# EAGLE design tiny-uC-13 (EAGLE 5.07)
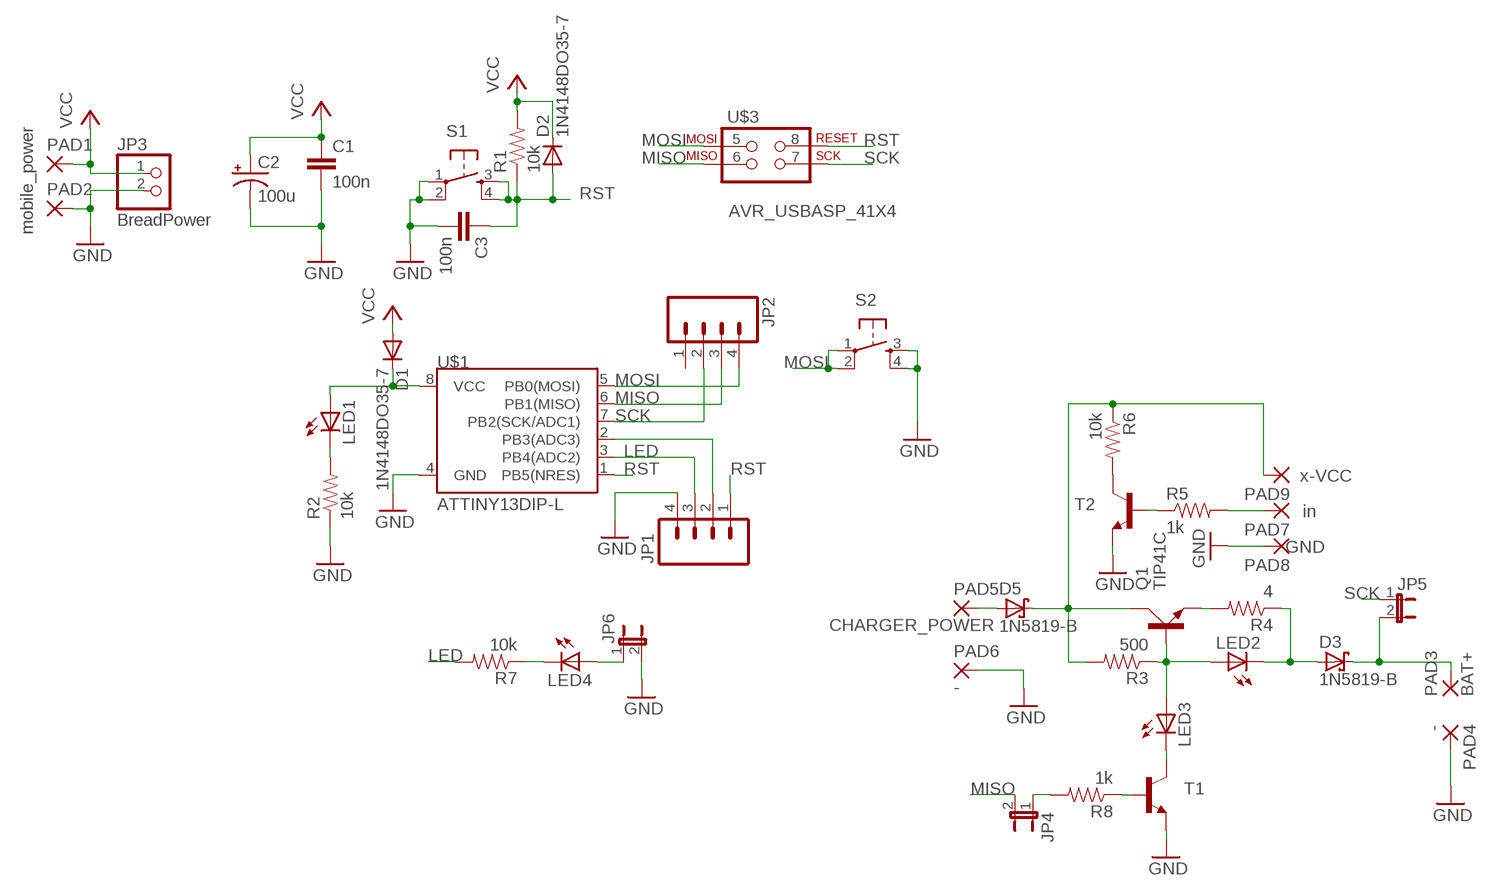
[diagram p0: schematic, sheet 1]

## Parts
C1  100n  CAP0805  [0805]
C2  100u  CAP_POLD  [PANASONIC_D]
C3  100n  CAP0805  [0805]
D1  1N4148DO35-7  [DO35-7]
D2  1N4148DO35-7  [DO35-7]
D3  1N5819-B  [DO41-7.6]
D5  1N5819-B  [DO41-7.6]
JP1  M04LOCK_LONGPADS  [1X04_LOCK_LONGPADS]
JP2  M04LOCK_LONGPADS  [1X04_LOCK_LONGPADS]
JP3  BreadPower  PINHD-1X2  [1X02]
JP4  JUMPER-2PTH  [1X02]
JP5  JUMPER-2PTH  [1X02]
JP6  JUMPER-2PTH  [1X02]
LED1  LEDCHIP-LED0805  [CHIP-LED0805]
LED2  LEDCHIP-LED0805  [CHIP-LED0805]
LED3  LEDCHIP-LED0805  [CHIP-LED0805]
LED4  LEDCHIP-LED0805  [CHIP-LED0805]
PAD1  mobile_power  2,54/0,8  [2,54/0,8]
PAD2  2,54/0,8  [2,54/0,8]
PAD3  BAT+  2,54/1,0  [2,54/1,0]
PAD4  -  2,54/1,0  [2,54/1,0]
PAD5  CHARGER_POWER  2,54/1,0  [2,54/1,0]
PAD6  -  2,54/1,0  [2,54/1,0]
PAD7  in  1,6/0,8  [1,6/0,8]
PAD8  GND  1,6/0,8  [1,6/0,8]
PAD9  x-VCC  1,6/0,8  [1,6/0,8]
Q1  TIP41C  [TO220AV]
R1  10k  RESISTOR1/4W  [AXIAL-0.3]
R2  10k  RESISTOR  [0805]
R3  500  RESISTOR  [0805]
R4  4  RESISTOR1/4W  [AXIAL-0.3]
R5  1k  RESISTOR  [0805]
R6  10k  RESISTOR  [0805]
R7  10k  RESISTOR  [0805]
R8  1k  RESISTOR  [0805]
S1  TAC_SWITCHPTH  [TACTILE-PTH]
S2  TAC_SWITCHPTH  [TACTILE-PTH]
T1  TRANSISTOR_NPNSOT23  [SOT23]
T2  TRANSISTOR_NPNSOT23  [SOT23]
U$1  ATTINY13DIP-L  [DIP08-L]
U$3  AVR_USBASP_41X4  [1X4]

## Nets
ADC: JP1.2 U$1.2(PB3(ADC3))
GND: C1.2 C2.- C3.2 JP1.4 JP3.2 JP6.2 PAD2.1(P) PAD4.1(P) PAD6.1(P) PAD8.1(P) R2.1 S1.1 S1.2 S2.3 S2.4 T1.2(E) T2.2(E) U$1.4(GND)
LED: JP1.3 R7.2 U$1.3(PB4(ADC2))
LI-CHARGE: D3.C JP5.2 PAD3.1(P)
MISO: JP2.3 JP4.2 U$1.6(PB1(MISO)) U$3.6
MOSI: JP2.4 S2.1 S2.2 U$1.5(PB0(MOSI)) U$3.5
N$2: R8.1 T1.1(B)
N$3: LED2.A LED3.A Q1.B R3.1
N$4: LED1.C R2.2
N$5: D1.C LED1.A U$1.8(VCC)
N$6: D3.A LED2.C R4.P$1
N$7: R6.2 T2.3(C)
N$8: Q1.E R4.P$2
N$9: JP4.1 R8.2
N$10: D5.C PAD9.1(P) Q1.C R3.2 R6.1
N$11: LED3.C T1.3(C)
N$12: R5.1 T2.1(B)
N$13: D5.A PAD5.1(P)
N$14: PAD7.1(P) R5.2
N$15: JP6.1 LED4.A
N$16: LED4.C R7.1
RST: C3.1 D2.A JP1.1 R1.P$1 S1.3 S1.4 U$1.1(PB5(NRES)) U$3.8
SCK: JP2.2 JP5.1 U$1.7(PB2(SCK/ADC1)) U$3.7
VCC: C1.1 C2.+ D1.A D2.C JP3.1 PAD1.1(P) R1.P$2
Unconnected: JP2.1

## Library data of the parts
C1 C3 = SparkFun:CAP: Capacitor Standard 0603 ceramic capacitor, and 0.1" leaded capacitor.
C2 = SparkFun:CAP_POL: Capacitor Polarized These are standard SMD and PTH capacitors. Normally 10uF, 47uF, and 100uF in electrolytic and tantalum varieties. Always verify the external diameter of the through hole cap, it varies with capacity, voltage, and manufacturer. The EIA devices should be standard.
D1 D2 = diode:1N4148: DIODE high speed (Philips)
D3 D5 = diode:1N581*: 1.0A SCHOTTKY BARRIER RECTIFIER Source: http://www.diodes.com/datasheets/ds23001.pdf
JP1 JP2 = SparkFun:M04: Header 4 Standard 4-pin 0.1" header. Use with straight break away headers (SKU : PRT-00116), right angle break away headers (PRT-00553), swiss pins (PRT-00743), machine pins (PRT-00117), and female headers (PRT-00115). Molex polarized connector foot print use with SKU : PRT-08231 with associated crimp pins and housings.
JP3 = pinhead:PINHD-1X2: PIN HEADER
JP4-JP6 = SparkFun:JUMPER-2: Jumper Basic 0.1" spaced jumper. Use with breakaway headers.
LED1-LED4 = led:LED: LED OSRAM: - CHIPLED LG R971, LG N971, LY N971, LG Q971, LY Q971, LO R971, LY R971 LH N974, LH R974 LS Q976, LO Q976, LY Q976 LO Q996 - Hyper CHIPLED LW Q18S LB Q993, LB Q99A, LB R99A - SideLED LS A670, LO A670, LY A670, LG A670, LP A670 LB A673, LV A673, LT A673, LW A673 LH A674 LY A675 LS A676, LA A676, LO A676, LY A676, LW A676 LS A679, LY A679, LG A679 - Hyper Micro SIDELED® LS Y876, LA Y876, LO Y876, LY Y876 LT Y87S - SmartLED LW L88C, LW L88S LB L89C, LB L89S, LG L890 LS L89K, LO L89K, LY L89K LS L896, LA L896, LO L896, LY L896 - TOPLED LS T670, LO T670, LY T670, LG T670, LP T670 LSG T670, LSP T670, LSY T670, LOP T670, LYG T670 LG T671, LOG T671, LSG T671 LB T673, LV T673, LT T673, LW T673 LH T674 LS T676, LA T676, LO T676, LY T676, LB T676, LH T676, LSB T676, LW T676 LB T67C, LV T67C, LT T67C, LS T67K, LO T67K, LY T67K, LW E67C LS E67B, LA E67B, LO E67B, LY E67B, LB E67C, LV E67C, LT E67C LW T67C LS T679, LY T679, LG T679 LS T770, LO T770, LY T770, LG T770, LP T770 LB T773, LV T773, LT T773, LW T773 LH T774 LS E675, LA E675, LY E675, LS T675 LS T776, LA T776, LO T776, LY T776, LB T776 LHGB T686 LT T68C, LB T68C - Hyper Mini TOPLED® LB M676 - Mini TOPLED Santana® LG M470 LS M47K, LO M47K, LY M47K Source: http://www.osram.convergy.de LUXEON: - LUMILED® LXK2-PW12-R00, LXK2-PW12-S00, LXK2-PW14-U00, LXK2-PW14-V00 LXK2-PM12-R00, LXK2-PM12-S00, LXK2-PM14-U00 LXK2-PE12-Q00, LXK2-PE12-R00, LXK2-PE12-S00, LXK2-PE14-T00, LXK2-PE14-U00 LXK2-PB12-K00, LXK2-PB12-L00, LXK2-PB12-M00, LXK2-PB14-N00, LXK2-PB14-P00, LXK2-PB14-Q00 LXK2-PR12-L00, LXK2-PR12-M00, LXK2-PR14-Q00, LXK2-PR14-R00 LXK2-PD12-Q00, LXK2-PD12-R00, LXK2-PD12-S00 LXK2-PH12-R00, LXK2-PH12-S00 LXK2-PL12-P00, LXK2-PL12-Q00, LXK2-PL12-R00 Source: www.luxeon.com KINGBRIGHT: KA-3528ASYC Source: www.kingbright.com
PAD1 PAD2 = wirepad:2,54/0,8: THROUGH-HOLE PAD
PAD3-PAD6 = wirepad:2,54/1,0: THROUGH-HOLE PAD
PAD7-PAD9 = wirepad:1,6/0,8: THROUGH-HOLE PAD
Q1 = transistor-power:TIP41C: NPN TRANSISTOR
R1-R8 = digital-toy:RESISTOR: Resistor Basic schematic elements and footprints for 0603, 1206, and PTH 1/10th watt (small) resistors.
S1 S2 = SparkFun:TAC_SWITCH: Momentary Switch Button commonly used for reset or general input. Spark Fun Electronics SKU : COM-00097
T1 T2 = SparkFun:TRANSISTOR_NPN: Transistor NPN BJT configuration in SOT23 package. MMBT2222 is the common NPN we use. Double check BCE configuration again layout.
U$1 = digital-toy:ATTINY13
U$3 = digital-toy:AVR_USBASP_4: AVR ISP 6 Pin This is the reduced ISP connector for AVR programming. Common on Arduino. This footprint will take up less PCB space and can be used with a 10-pin to 6-pin adapter such as SKU: BOB-08508

## Board
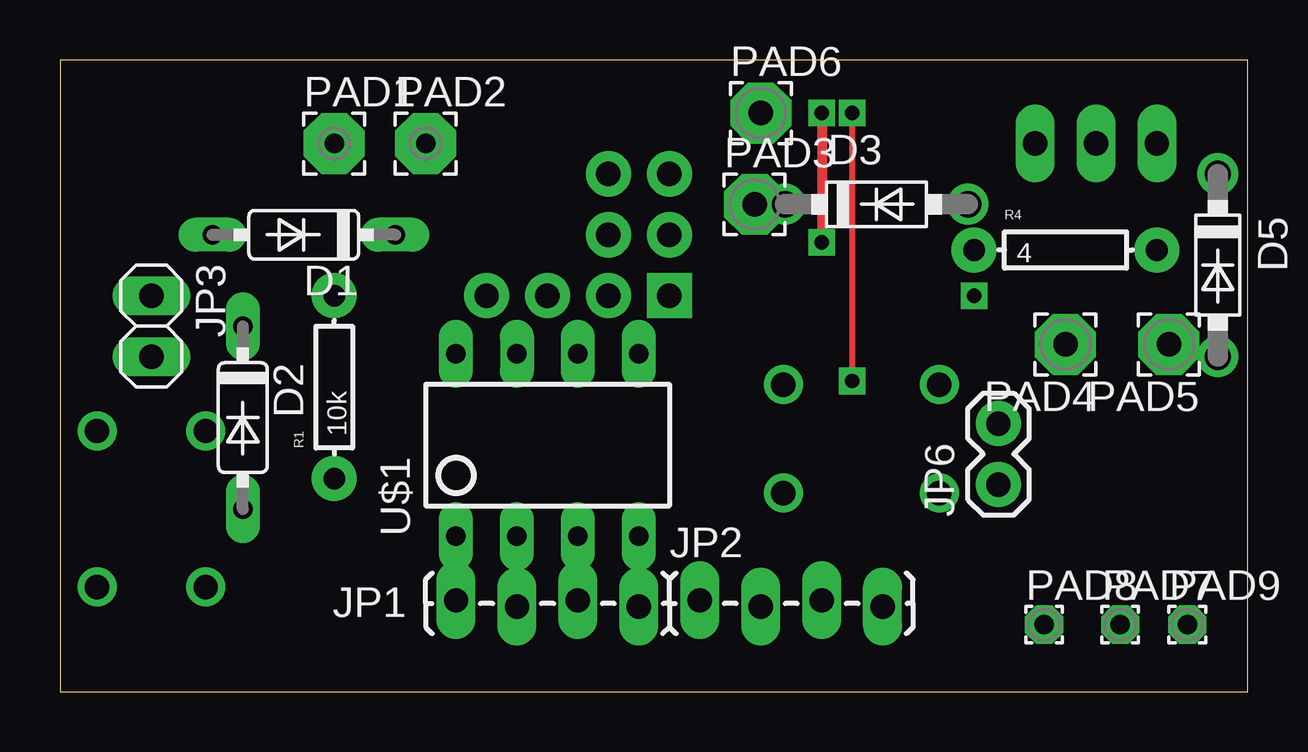
[diagram p1: board, top side]
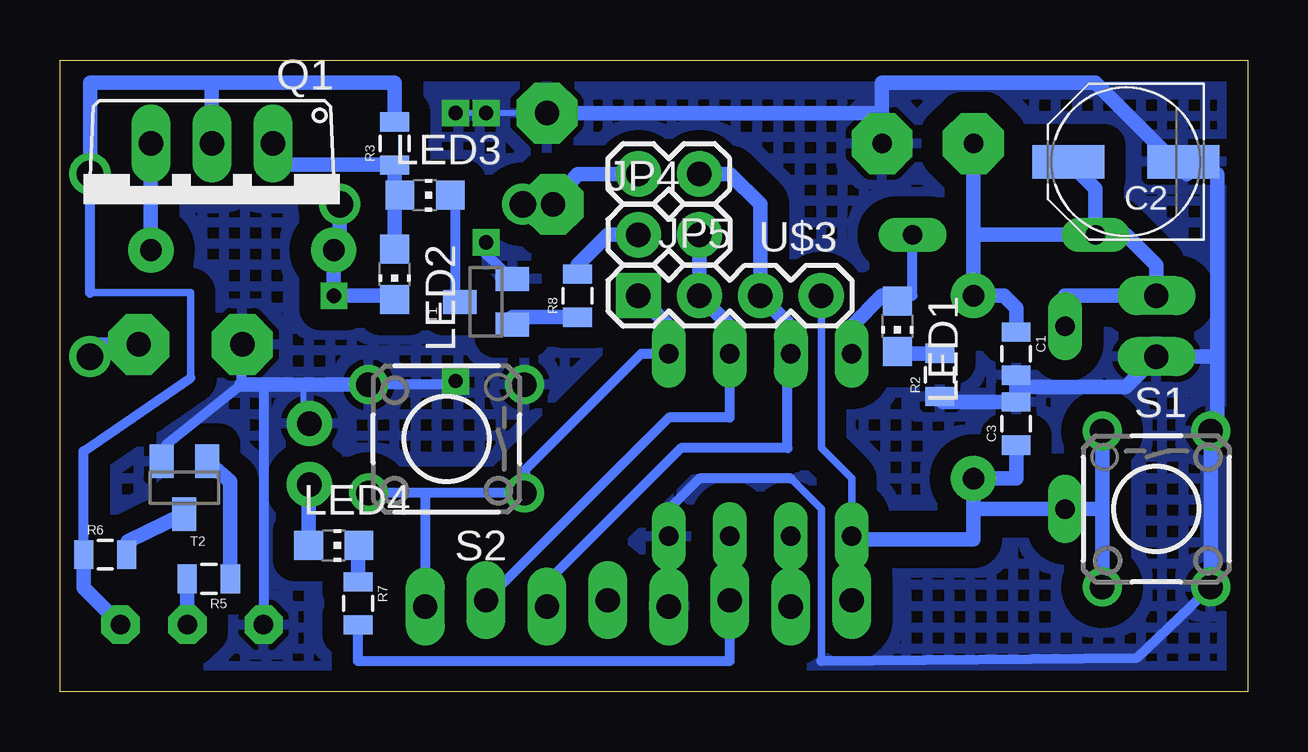
[diagram p2: board, bottom side, seen from below]

Size 49.51 x 26.34 mm. Coordinates in mm from the lower left corner, seen from the top.
Outline: 0,0 49.51,0 49.51,26.34 0,26.34 0,0
Copper layers (1*16): Top 0.035mm / dielectric 1.5mm / Bottom 0.035mm
Design rules "SparkFun-diy": minimum track width 8mil, minimum drill 20mil, track to track 10mil, track to pad 10mil, pad to pad 10mil, via to via 10mil, smd to smd 10mil, copper to edge 10mil, drill to drill 8mil, minimum pad ring 12mil, minimum via ring 10mil, stop-mask expansion 4mil, vias tented up to drill 25mil, thermal gap 10mil

### Footprints (pad centres in the part's own frame; a part is rotated, then mirrored left to right if it is on the bottom)
0805 = smd 0.8 x 1.2: 1 -0.9,0; 2 0.9,0
PANASONIC_D = smd 3 x 1.4: + 2.4,0; - -2.4,0
DO35-7 = drill 0.813 long: A 3.81,0; C -3.81,0
DO41-7.6 = drill 1.1 pad 1.7 round: A 3.81,0; C -3.81,0
1X04_LOCK_LONGPADS = drill 1.016 long: 1 0,0; 2 2.54,-0.254; 3 5.08,0; 4 7.62,-0.254
1X02 = drill 1.016 long: 1 -1.27,0; 2 1.27,0
1X02' = drill 1.016 pad 1.88 round: 1 0,0; 2 2.54,0
CHIP-LED0805 = smd 1.2 x 1.2: A 0,-1.05; C 0,1.05
2,54/0,8 = drill 0.813 pad 2.54 octagon: 1 0,0
2,54/1,0 = drill 1.016 pad 2.54 octagon: 1 0,0
1,6/0,8 = drill 0.813 pad 1.6 octagon: 1 0,0
TO220AV = drill 1.016 long: B -2.54,-2.54; C 0,-2.54; E 2.54,-2.54
AXIAL-0.3 = drill 0.9 pad 1.88 round: P$1 -3.81,0; P$2 3.81,0
TACTILE-PTH = drill 1.016 round: 1 -3.251,2.261; 2 3.251,2.261; 3 -3.251,-2.261; 4 3.251,-2.261
SOT23 = smd 1 x 1.4: 1 -0.95,-1.1; 2 0.95,-1.1; 3 0,1.1
DIP08-L = drill 0.813 long: 1 0,-2.54; 2 2.54,-2.54; 3 5.08,-2.54; 4 7.62,-2.54; 5 7.62,5.08; 6 5.08,5.08; 7 2.54,5.08; 8 0,5.08
1X4 = drill 1.016 pad 1.88 square: 5 0,0 | drill 1.016 pad 1.88 round: 6 2.54,0; 7 5.08,0; 8 7.62,0

### Placement (x,y rotation side)
C1  9.65,14.1 270 bottom
C2  5.08,22.1 180 bottom
C3  9.65,11.18 90 bottom
D1  10.16,19.05 180 top
D2  7.62,11.43 270 top
D3  34.04,20.32 0 top
D5  48.26,17.78 270 top
JP1  16.51,3.81 0 top
JP2  26.67,3.81 0 top
JP3  3.81,15.24 270 top
JP4  [1X02']  25.4,19.05 0 bottom
JP5  [1X02']  22.86,21.59 180 bottom
JP6  [1X02']  39.12,8.64 90 top
LED1  14.61,15.24 180 bottom
LED2  red  [CHIP-LED0805]  35.56,17.4 180 bottom
LED3  Green  [CHIP-LED0805]  34.29,20.7 270 bottom
LED4  Yellow  [CHIP-LED0805]  38.1,6.1 270 bottom
PAD1  11.43,22.86 0 top
PAD2  15.24,22.86 0 top
PAD3  28.96,20.32 0 top
PAD4  41.91,14.48 180 top
PAD5  46.23,14.48 180 top
PAD6  29.21,24.13 0 top
PAD7  44.2,2.79 0 top
PAD8  41.02,2.79 0 top
PAD9  46.99,2.79 0 top
Q1  43.18,20.32 180 bottom
R1  11.43,12.7 90 top
R2  12.83,13.21 90 bottom
R3  35.56,22.86 90 bottom
R4  41.91,18.41 0 top
R5  43.31,4.7 180 bottom
R6  47.62,5.71 0 bottom
R7  1k  [0805]  37.08,3.68 270 bottom
R8  27.94,16.51 90 bottom
S1  3.81,7.62 270 bottom
S2  33.4,10.54 180 bottom
T1  9014  [SOT23]  31.75,16.26 90 bottom
T2  9014  [SOT23]  44.32,8.51 180 bottom
U$1  16.51,9.02 0 top
U$3  25.4,16.51 0 bottom

### Tracks (layer width: path | path; a pad name or v marks a point on that pad's centre or on a via)
ADC
  Bottom 0.406: JP1.2 U$1.2
GND  (via drill 0.6)
  Top 0.254: v33.02,24.13 v33.02,12.95
  Top 0.406: v31.75,24.13 v31.75,18.73
  Bottom 0.203: C2.- 2.54,21.59
  Bottom 0.254: 12.7,12.08 R2.1 | 24.13,7.62 U$1.4 | PAD6.1 v31.75,24.13 v33.02,24.13 | T2.2 45.34,9.99 45.09,10.29 | JP6.2 39.37,11.43 39.37,12.8
  Bottom 0.305: 19.05,8.89 17.78,7.62 17.78,1.27 | 15.24,24.13 PAD2.1
  Bottom 0.406: S1.2 2.4,3.54 4.65,1.4 17.78,1.27 | U$1.4 JP1.4 | 24.13,7.62 22.86,8.89 19.05,8.89 | PAD4.1 41.94,12.8 45.09,10.29 | 41.02,12.8 PAD8.1 | T1.2 31.75,18.22 v31.75,18.73 | S2.4 33.02,12.8 v33.02,12.95
  Bottom 0.61: 9.65,12.7 C3.2 12.7,12.08 | 9.65,12.7 C1.2 | 1.27,13.97 1.27,11.43 S1.1 S1.2 | 1.27,13.97 1.27,21.59 C2.- | 1.27,13.97 JP3.2 5.08,12.7 9.65,12.7 | 2.54,21.59 6.35,25.4 15.24,25.4 15.24,24.13 PAD6.1 | S2.4 39.37,12.8 41.02,12.8 41.94,12.8
  pour Bottom (isolate 0.889, hatched): -2.54,27.94 52.07,27.94 52.07,-2.54 -2.54,-2.54
LED
  Bottom 0.254: R7.2
  Bottom 0.406: JP1.3 21.59,1.27 37.08,1.27 R7.2
  Bottom 0.61: JP1.3 U$1.3
LI-CHARGE
  Bottom 0.61: D3.C PAD3.1 27.94,21.59 JP5.2
MISO
  Bottom 0.203: 21.59,13.97 U$1.6
  Bottom 0.406: 21.59,13.97 21.59,11.43 24.13,11.43 JP2.3
  Bottom 0.61: U$1.6 21.59,15.24 U$3.6 JP4.2
MOSI
  Bottom 0.203: U$1.5 24.13,13.97
  Bottom 0.254: 24.26,14.1 U$1.5
  Bottom 0.406: 34.29,8.28 S2.1 30.1,8.36 30.1,9.27 25.27,14.1 24.26,14.1 | 34.29,8.28 S2.2 | 34.29,8.28 JP2.4
  Bottom 0.61: 24.26,14.1 24.26,15.37 U$3.5
N$2
  Bottom 0.254: R8.1 28.19,15.62
  Bottom 0.61: 28.19,15.62 30.65,15.62 T1.1
N$3
  Bottom 0.203: R3.1 | LED3.A 35.56,20.32
  Bottom 0.61: R3.1 40.64,21.97 Q1.B | LED2.A 35.56,20.32 R3.1
N$4
  Bottom 0.254: LED1.C 14.52,14.11
  Bottom 0.61: 14.52,14.11 R2.2
N$5
  Bottom 0.254: 15.24,16.51 LED1.A 14.38,16.51 13.97,16.51
  Bottom 0.406: 13.97,16.51 D1.C
  Bottom 0.61: U$1.8 16.51,15.24 15.24,16.51
N$6  (via drill 0.6)
  Bottom 0.203: LED2.C 35.56,16.51
  Bottom 0.61: 35.56,16.51 v38.1,16.51 R4.P$1 37.85,18.67 D3.A
N$7
  Bottom 0.61: T2.3 46.68,6.27 R6.2
N$8
  Bottom 0.61: R4.P$2 Q1.E
N$9
  Bottom 0.203: R8.2 27.94,17.78
  Bottom 0.61: 27.94,17.78 26.67,19.05 JP4.1
N$10
  Bottom 0.305: 48.26,16.64 44.07,16.64 44.07,13.08
  Bottom 0.406: 48.26,16.64 D5.C | R6.1 48.52,10.02 44.07,13.08
  Bottom 0.61: 43.18,25.4 35.56,25.4 R3.2 | 43.18,25.4 Q1.C | 43.18,25.4 48.26,25.4 D5.C | PAD9.1 48.01,3.81 48.51,4.33 R6.1
N$11
  Bottom 0.406: LED3.C 33.02,20.7 33.02,16.51 32.89,16.26 T1.3
N$12
  Bottom 0.61: R5.1 42.41,8.77 T2.1
N$13
  Bottom 0.61: D5.A 48.13,14.48 PAD5.1
N$14
  Bottom 0.61: PAD7.1 44.21,4.46 R5.2
N$15
  Bottom 0.254: 39.15,8.6 JP6.1
  Bottom 0.61: LED4.A 39.15,8.6
N$16
  Bottom 0.254: 37.08,6.06 LED4.C
  Bottom 0.61: R7.1 37.08,6.06
RST
  Bottom 0.254: 11.43,7.62 R1.P$1 | 16.38,6.35 U$1.1
  Bottom 0.305: U$1.1 16.51,8.89 17.78,10.16 U$3.8
  Bottom 0.406: U$1.1 JP1.1
  Bottom 0.61: 11.43,7.62 D2.A 6.07,7.62 | C3.1 9.65,8.89 R1.P$1 11.43,6.35 16.38,6.35 | S1.4 6.07,7.62 | 6.07,7.62 S1.3
SCK
  Bottom 0.203: U$1.7 19.05,13.97
  Bottom 0.254: 19.18,14.1 U$1.7
  Bottom 0.406: 19.18,14.1 19.18,10.16 23.62,10.16 29.21,4.57 JP2.2
  Bottom 0.61: 19.18,14.1 19.18,15.37 U$3.7 20.32,20.32 21.59,21.59 JP5.1
VCC
  Bottom 0.61: 11.43,19.05 R1.P$2 10.16,16.51 9.65,16 C1.1 | 11.43,19.05 PAD1.1 | D1.A 11.43,19.05 | D2.C 7.62,16.51 JP3.1 3.81,17.78 5.08,19.05 D1.A | D1.A 6.35,20.97 C2.+